# EasyEDA Pro project ADX_IDCtoPinheader_adapter_2026-04-28.epro

# Schematic Schematic1
Board Name: Board1; Create Date: 2026-04-24; Page Name: P1; Project Name: ADX_GPIO_Breakout_Board; Schematic Name: Schematic1; Update Date: 2026-04-24; Company: EasyEDA.com; Page Size: A4; Version: V1.0
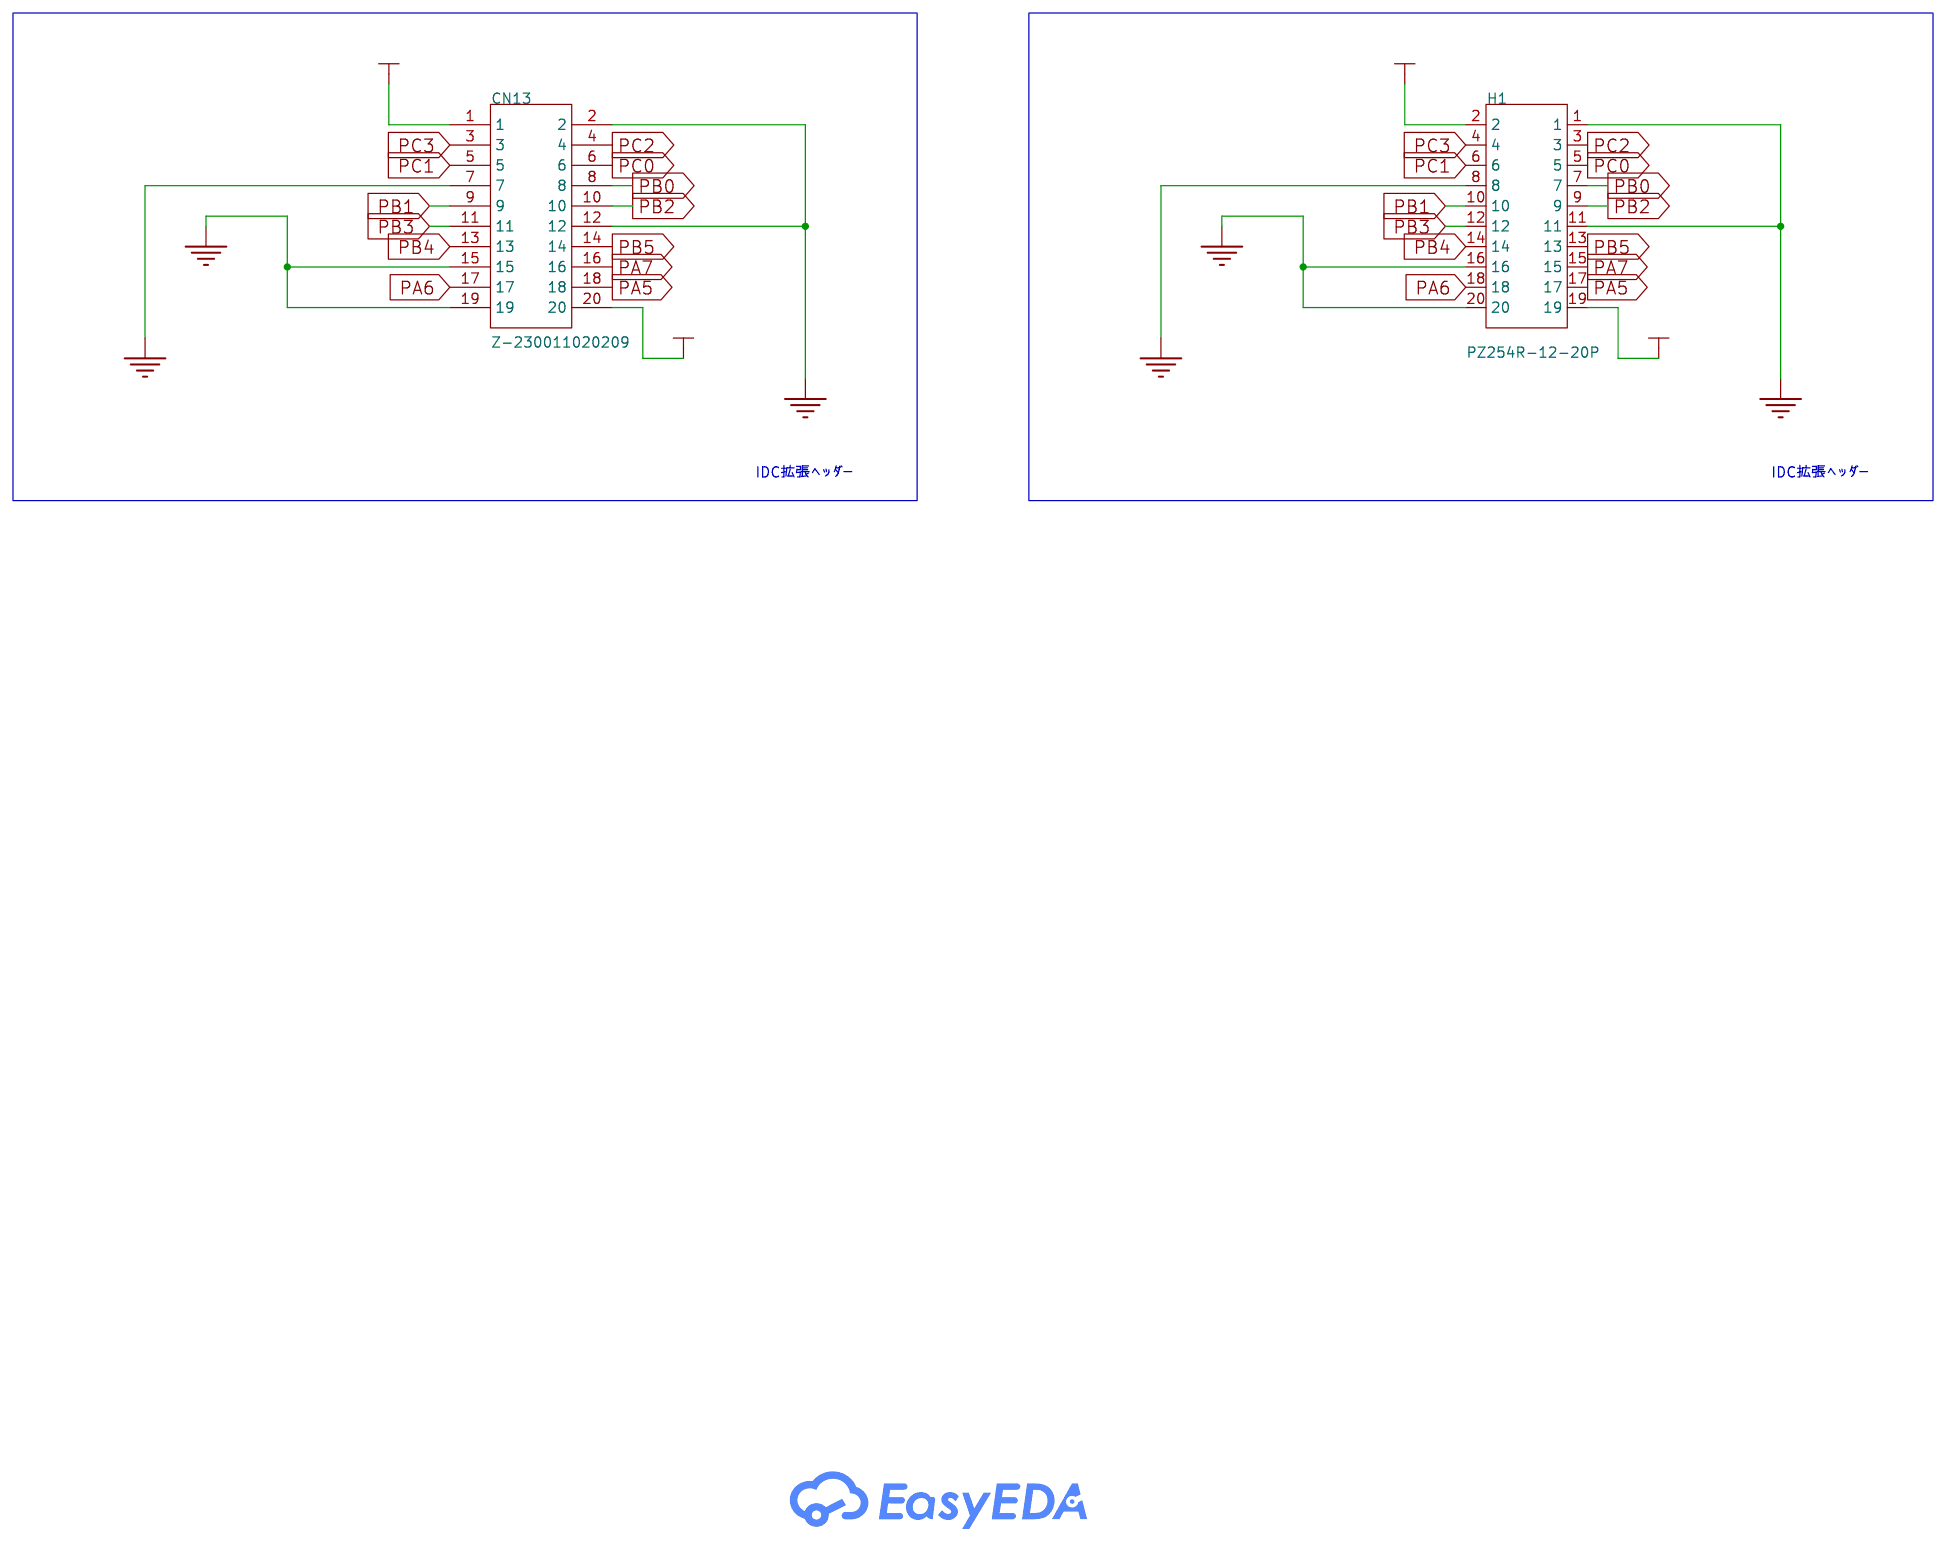
[diagram p0: schematic sheet]

## Parts
CN13  Z-230011020209  [IDC-TH_20P-P2.54_Z-230011020209]
H1  PZ254R-12-20P  [HDR-TH_20P-P2.54-H-M-R2-C10-S2.54]

## Library data of the parts
CN13 = Z-230011020209: Connector Type:Horn buckle Pitch:2.54mm Structure:2x10P Holder Type:Right-Angle Row Spacing:2.54mm Number of Rows:2 Pin Number in each Row:10 Contact Material:Copper Alloy Contact Plating:Gold; LCSC Part Name: 2.54mm 2x10P 排数:2 每排P数:10 黑色; Supplier Part: C221002; Manufacturer: Nextron(正凌); Supplier Footprint: 弯插,P=2.54mm; JLCPCB Part Class: Extended Part; Datasheet: https://atta.szlcsc.com/upload/public/pdf/source/20180731/C221012_6A24CDA93994749D0946806D4F08BD76.pdf; Supplier: LCSC; Connector Type: Horn buckle; Pitch: 2.54mm; Structure: 2x10P; Holder Type: Right-Angle; Row Spacing: 2.54mm; Number of Rows: 2; Pin Number in each Row: 10; Contact Material: Copper Alloy; Contact Plating: Gold
H1 = PZ254R-12-20P: Pin Structure:2x10P Pitch:2.54mm Row Spacing:2.54mm Circluar Pins/Square Pins:Pin Header Mounting Type:Right Angle Number of Rows:2 Number of Pins:20P Current Rating:- Voltage Rating (Max):- Length of Mating Pin:6mm Insulation Height:2.5mm Contact Materia; LCSC Part Name: 2x10P 间距:2.54mm 方针 弯插; Supplier Part: C492438; Manufacturer: XFCN(兴飞); Supplier Footprint: 弯插,P=2.54mm; JLCPCB Part Class: Extended Part; Datasheet: https://item.szlcsc.com/datasheet/PZ254R-12-20P/502994.html; Supplier: LCSC; Pin Structure: 2x10P; Pitch: 2.54mm; Row Spacing: 2.54mm; Circluar Pins/Square Pins: Pin Header; Mounting Type: Right Angle; Number of Rows: 2; Number of Pins: 20P; Length of Mating Pin: 6mm; Insulation Height: 2.5mm; Contact Material: Brass; Operating Temperature: -40℃~+105℃; Color: Black

## Nets
GND_5V: CN13.2 CN13.7 CN13.12 CN13.15 CN13.19 H1.1 H1.8 H1.11 H1.16 H1.20
VDD1: CN13.1 H1.2
VDD2: CN13.20 H1.19
PA5: CN13.18 H1.17
PA6: CN13.17 H1.18
PA7: CN13.16 H1.15
PB0: CN13.8 H1.7
PB1: CN13.9 H1.10
PB2: CN13.10 H1.9
PB3: CN13.11 H1.12
PB4: CN13.13 H1.14
PB5: CN13.14 H1.13
PC0: CN13.6 H1.5
PC1: CN13.5 H1.6
PC2: CN13.4 H1.3
PC3: CN13.3 H1.4

## Notes on the sheet
- IDC拡張ヘッダー
- IDC拡張ヘッダー

# Board PCB1
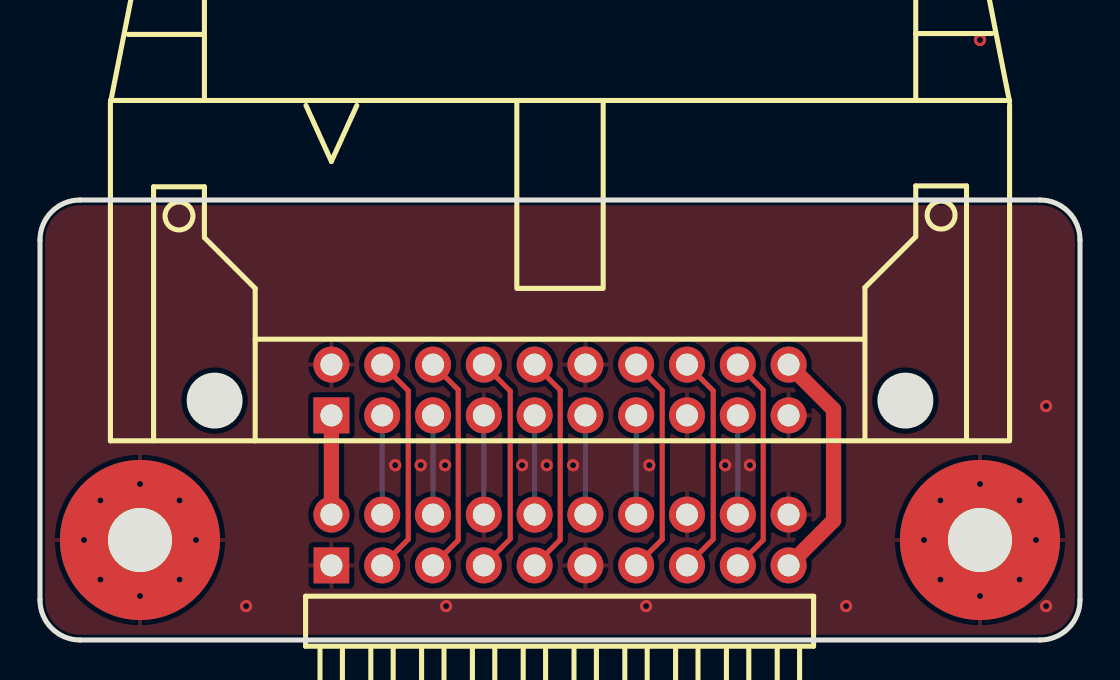
[diagram p1: board, top side]
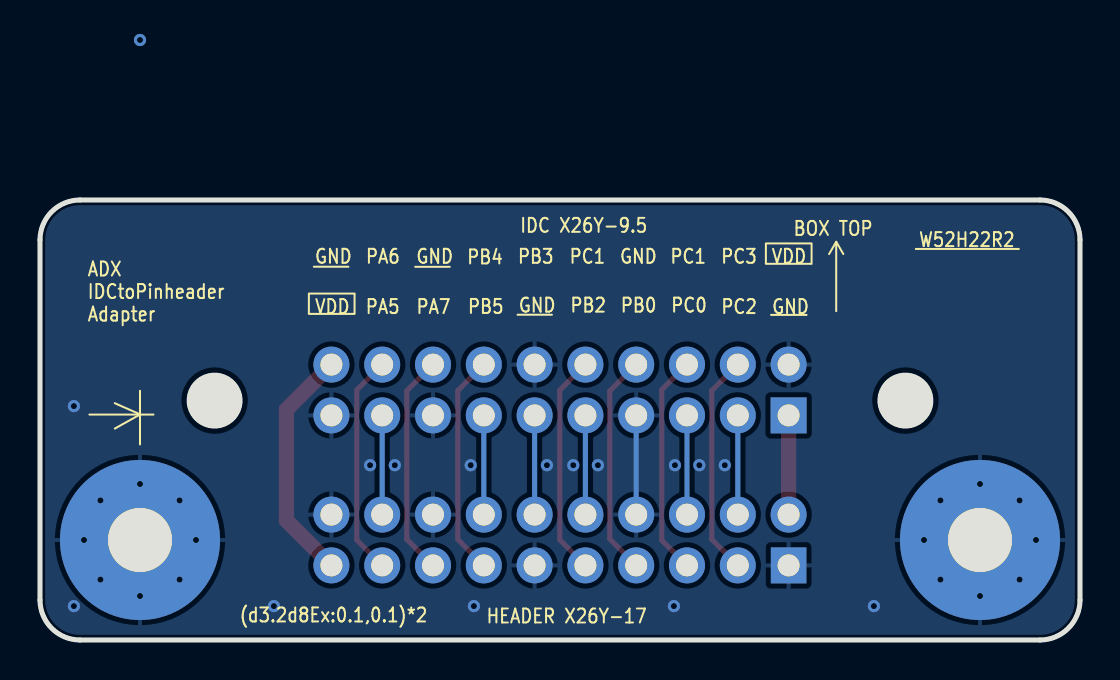
[diagram p2: board, bottom side, seen from below]

Outline 52 x 22 mm; copper layers: Top Layer, Bottom Layer. Coordinates in mm from the lower left corner of the outline.
Outline path: 0,20 0,2 arc(0.59,0.59) 2,0 50,0 arc(51.41,0.59) 52,2 52,20 arc(51.41,21.41) 50,22 2,22 arc(0.59,21.41) 0,20
Stack: Top Layer 0.035mm / Dielectric1 1.51mm FR4 er 4.5 / Bottom Layer 0.035mm

## Design rules (mm)
template: JLCPCB Capability(Two Layers Board)
spacing copperThickness1oz (default): track to track 0.102, other pairs 0.152 to 0.3
spacing copperThickness2oz: track to track 0.203, other pairs 0.152 to 0.3
track width copperThickness1oz (default): min 0.127, default 0.254, max 2.54
track width copperThickness2oz: min 0.203, default 0.254, max 2.54
differential pair differentialPair (default): width min 0.127, default 0.254, max 2.54; gap min 0.152, default 0.152
via viaSize (default): diameter min 0.5, default 0.61, max 10; hole min 0.3, default 0.305, max 6.3

## Placement (name value [footprint] x y rotation side)
CN13  Z-230011020209  [IDC-TH_20P-P2.54_Z-230011020209]  26 12.5 180 top
H1  PZ254R-12-20P  [HDR-TH_20P-P2.54-H-M-R2-C10-S2.54]  26 5 0 top
NOREF  -  [Pad_e101]  47 5 0 top
NOREF#2  -  [Pad_e100]  5 5 0 top

## Footprints (pads in the part's own frame, mm; a bottom-side part is the same pattern mirrored in y, then rotated)
HDR-TH_20P-P2.54-H-M-R2-C10-S2.54
  rect 1.778x1.8 hole 1.1: 1(-11.43,-1.27)
  round 1.8 hole 1.1: 2(-11.43,1.27) 3(-8.89,-1.27) 4(-8.89,1.27) 5(-6.35,-1.27) 6(-6.35,1.27) 7(-3.81,-1.27) 8(-3.81,1.27) 9(-1.27,-1.27) 10(-1.27,1.27) 11(1.27,-1.27) 12(1.27,1.27) 13(3.81,-1.27) 14(3.81,1.27) 15(6.35,-1.27) 16(6.35,1.27) 17(8.89,-1.27) 18(8.89,1.27) 19(11.43,-1.27) 20(11.43,1.27)
IDC-TH_20P-P2.54_Z-230011020209
  rect 1.8x1.8 hole 1.1: 1(11.43,1.27)
  round 1.8 hole 1.1: 2(11.43,-1.27) 3(8.89,1.27) 4(8.89,-1.27) 5(6.35,1.27) 6(6.35,-1.27) 7(3.81,1.27) 8(3.81,-1.27) 9(1.27,1.27) 10(1.27,-1.27) 11(-1.27,1.27) 12(-1.27,-1.27) 13(-3.81,1.27) 14(-3.81,-1.27) 15(-6.35,1.27) 16(-6.35,-1.27) 17(-8.89,1.27) 18(-8.89,-1.27) 19(-11.43,1.27) 20(-11.43,-1.27)
Pad_e100
  round 8 hole 3.2: 1(0,0)
Pad_e101
  round 8 hole 3.2: 2(0,0)

## Nets
As in the schematic, except:
GND_5V: CN13.2 CN13.7 CN13.12 CN13.15 CN13.19 H1.1 H1.8 H1.11 H1.16 H1.20 NOREF.2 NOREF#2.1

## Via types
v1: diameter 0.61, hole 0.305, Top Layer to Bottom Layer, 32 vias

## Routing (per net, layer and track width the routed paths; a pad name or vN(x,y) marks a point on that pad's centre or on a via; arc(x,y) is an arc through that point)
GND_5V: length 5
  Bottom Layer w0.254: CN13.7 H1.8
  vias: v1(2.2,5) v1(3.02,6.98) v1(3.02,3.02) v1(5,7.8) v1(5,2.2) v1(6.98,6.98) v1(6.98,3.02) v1(7.8,5) v1(10.31,1.69) v1(17.76,8.74) v1(19.03,8.74) v1(20.25,8.74) v1(20.31,1.69) v1(24.1,8.74) v1(25.34,8.74) v1(26.65,8.74) v1(30.31,1.69) v1(30.46,8.74) v1(34.26,8.74) v1(35.5,8.74) v1(40.31,1.69) v1(44.2,5) v1(45.02,6.98) v1(45.02,3.02) v1(47,7.8) v1(47,2.2) v1(48.98,6.98) v1(48.98,3.02) v1(49.8,5) v1(50.31,11.69) v1(50.31,1.69)
VDD1: length 5
  Top Layer w0.762: CN13.1 H1.2
VDD2: length 11.9
  Top Layer w0.762: H1.19 39.68,5.98 39.68,11.52 CN13.20
(no net):
  vias: v1(47,30)
PA5: length 11.1
  Top Layer w0.254: H1.17 36.16,5 36.16,12.5 CN13.18
PA6: length 5
  Bottom Layer w0.254: CN13.17 H1.18
PA7: length 11.1
  Top Layer w0.254: CN13.16 33.66,12.46 33.66,5.04 H1.15
PB0: length 11.1
  Top Layer w0.254: CN13.8 23.51,12.45 23.51,5.05 H1.7
PB1: length 5
  Bottom Layer w0.254: CN13.9 H1.10
PB2: length 11.1
  Top Layer w0.254: CN13.10 26.01,12.49 26.01,5.01 H1.9
PB3: length 5
  Bottom Layer w0.254: CN13.11 H1.12
PB4: length 5
  Bottom Layer w0.254: CN13.13 H1.14
PB5: length 11.1
  Top Layer w0.254: CN13.14 31.11,12.47 31.11,5.03 H1.13
PC0: length 11.1
  Top Layer w0.254: H1.5 20.91,4.99 20.91,12.51 CN13.6
PC1: length 5
  Bottom Layer w0.254: CN13.5 H1.6
PC2: length 11.1
  Top Layer w0.254: H1.3 18.41,5.03 18.41,12.47 CN13.4
PC3: length 5
  Bottom Layer w0.254: CN13.3 H1.4

## Copper pours and planes (outline as drawn; the poured copper is in the pictures)
GND_5V on Top Layer: -2.75,24.19 54.67,24.19 54.67,-3.04 -2.75,-3.04
GND_5V on Bottom Layer: -4.18,25.83 56.15,25.83 56.15,-3.86 -4.18,-3.86

## Text on the board
Bottom Silkscreen Layer: W52H22R2 | BOX TOP | IDC X26Y-9.5 | HEADER X26Y-17 | (d3.2d8Ex:0.1,0.1)*2 | ADX / IDCtoPinheader / Adapter | GND | VDD | PC2 | PC3 | PC0 | PC1 | PB0 | PB2 | PB3 | PB5 | PB4 | PA7 | PA6 | PA5
